# Altium schematic sheet MOTOR_DRIVERS.SchDoc
size A4; SheetNumber: 3; SheetTotal: 7
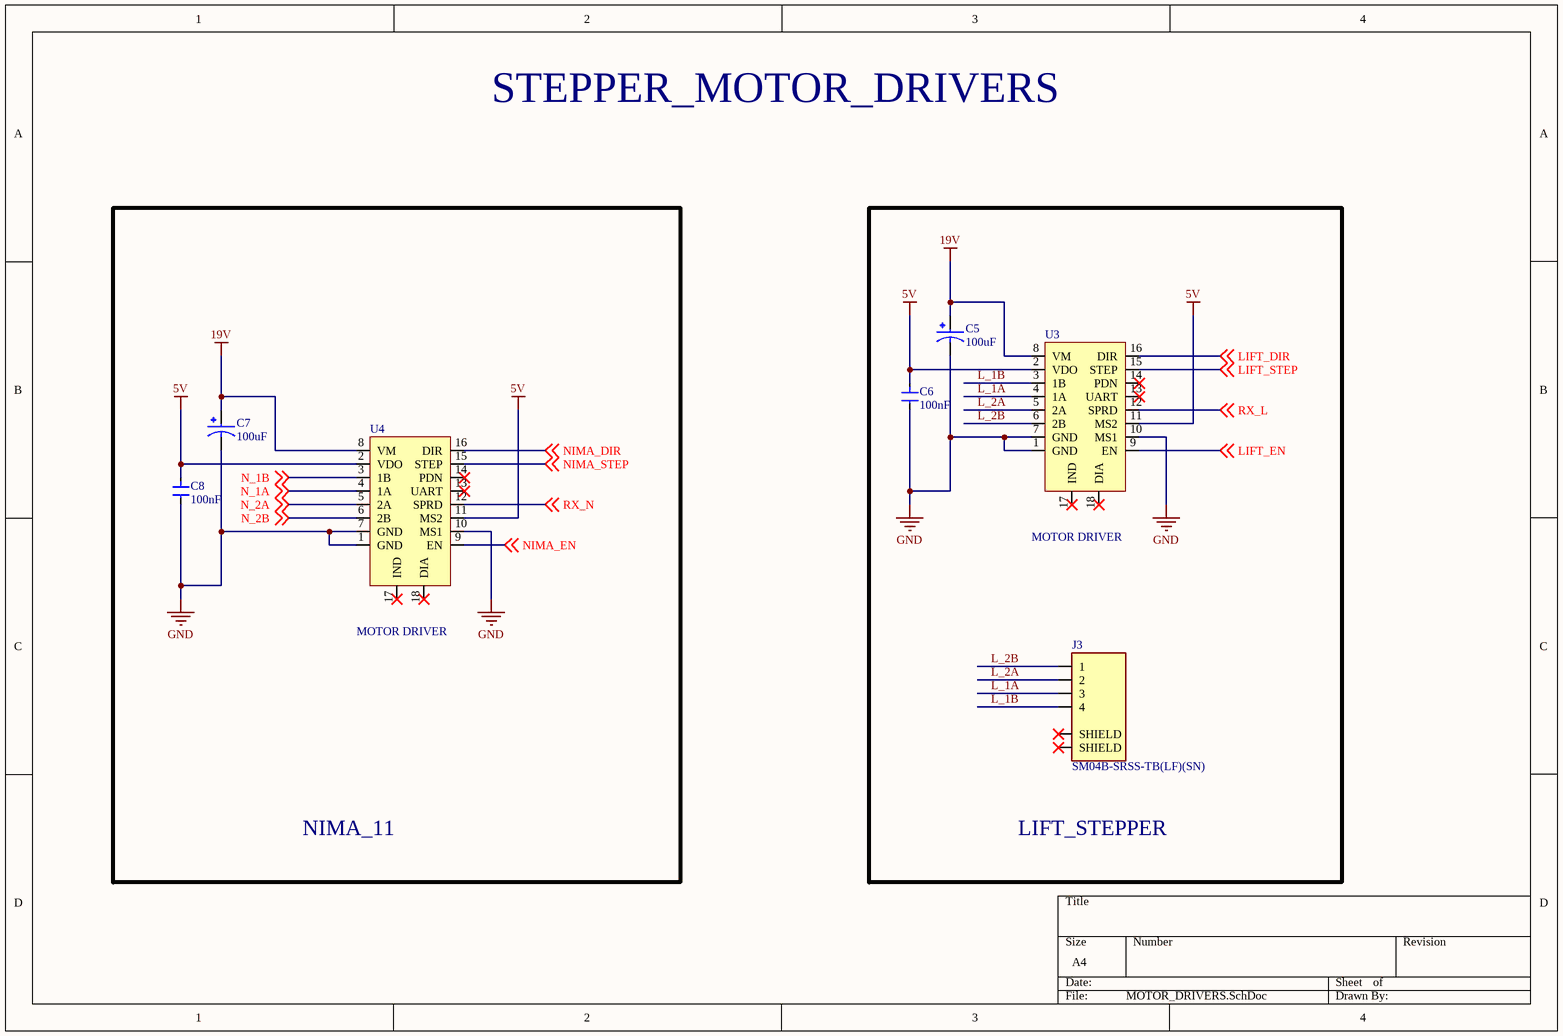
[diagram p0: MOTOR_DRIVERS.SchDoc]

## Parts
C5  100uF  [CAP_EEEFTH101XAP]
C6  100nF  [CAP 0603]
C7  100uF  [CAP_EEEFTH101XAP]
C8  100nF  [CAP 0603]
J3  SM04B-SRSS-TB(LF)(SN)  [CONN-TH_B4B-PH-K-S]
U3  MOTOR DRIVER  [MOTOR DRIVER]
U4  MOTOR DRIVER  [MOTOR DRIVER]

## Blocks framed on the sheet
NIMA_11: C7 C8 U4
LIFT_STEPPER: C5 C6 J3 U3

## Nets
5V: C6.1 C8.1 U3.2(VDO) U3.11(MS2) U4.2(VDO) U4.11(MS2)
19V: C5.1 C7.1 U3.8(VM) U4.8(VM)
GND: C5.2 C6.2 C7.2 C8.2 U3.1(GND) U3.7(GND) U3.10(MS1) U4.1(GND) U4.7(GND) U4.10(MS1)
L_1A: J3.3 U3.4(1A)
L_1B: J3.4 U3.3(1B)
L_2A: J3.2 U3.5(2A)
L_2B: J3.1 U3.6(2B)
LIFT_DIR: U3.16(DIR) ; off-sheet LIFT_DIR
LIFT_EN: U3.9(EN) ; off-sheet LIFT_EN
LIFT_STEP: U3.15(STEP) ; off-sheet LIFT_STEP
N_1A: U4.4(1A) ; off-sheet N_1A
N_1B: U4.3(1B) ; off-sheet N_1B
N_2A: U4.5(2A) ; off-sheet N_2A
N_2B: U4.6(2B) ; off-sheet N_2B
NIMA_DIR: U4.16(DIR) ; off-sheet NIMA_DIR
NIMA_EN: U4.9(EN) ; off-sheet NIMA_EN
NIMA_STEP: U4.15(STEP) ; off-sheet NIMA_STEP
RX_L: U3.12(SPRD) ; off-sheet RX_L
RX_N: U4.12(SPRD) ; off-sheet RX_N

Not connected (* = marked no-connect by the designer): J3 S1(SHIELD)* S2(SHIELD)*; U3 13(UART)* 14(PDN)* 17(IND)* 18(DIA)*; U4 13(UART)* 14(PDN)* 17(IND)* 18(DIA)*

## Notes on the sheet
- STEPPER_MOTOR_DRIVERS

## Library data of the parts
C5 C7 = EEEFTH101XAP: 100ÂµF 50V Aluminum Electrolytic Capacitors Radial, Can - SMD 340mOhm @ 100kHz 2000 Hrs @ 105Â°C; Manufacture: PANASONIC; Part Number: EEEFTH101XAP; Footprint size: SMD,D6.3xL7.7mm; Supplier: LCSC; Supplier Part Number: C165974; Link: https://www.lcsc.com/product-detail/C165974.html?spm=wm.fly.bg.0.xh___wm.fly.tp.1.ml&lcsc_vid=RFYMBlMFQAQLUVJeFVJZXwVeRFYIAgBXEVkPUlxRRVUxVlNRQVleUVNURlVfUDsOAxUeFF5JWBYZEEoKFBINSQcJGk4NBhADEA4cHktXRlVcSQwSGg0%3D
C6 C8 = Capasitor: Part Number: CC0603JRX7R9BB104; Manufacture: YAGEO; Footprint size: 0603; ComponentLink1Description: New link; ComponentLink1URL: *; Supplier: LCSC; Supplier Part Number: C91183; Link: https://www.lcsc.com/product-detail/C91183.html
J3 = SM04B-SRSS-TB(LF)(SN): Connector Header Surface Mount, Right Angle 4 position 0.039 (1.00mm); Manufacture: JST; Part Number: B4B-PH-K-S(LF)(SN); Footprint size: Through Hole,P=2mm; Supplier: LCSC; Supplier Part Number: C131334; Link: https://www.lcsc.com/product-detail/C131334.html?spm=wm.fly.bg.0.xh___wm.sxq.ssx.dcs.1&lcsc_vid=RFYMBlMFQAQLUVJeFVJZXwVeRFYIAgBXEVkPUlxRRVUxVlNRT1FbVVBSRFBeUjsOAxUeFF5JWBYZEEoKFBINSQcJGk4%3D